# Altium schematic sheet PWR.SchDoc
size A4; SheetNumber: 1; SheetTotal: 14
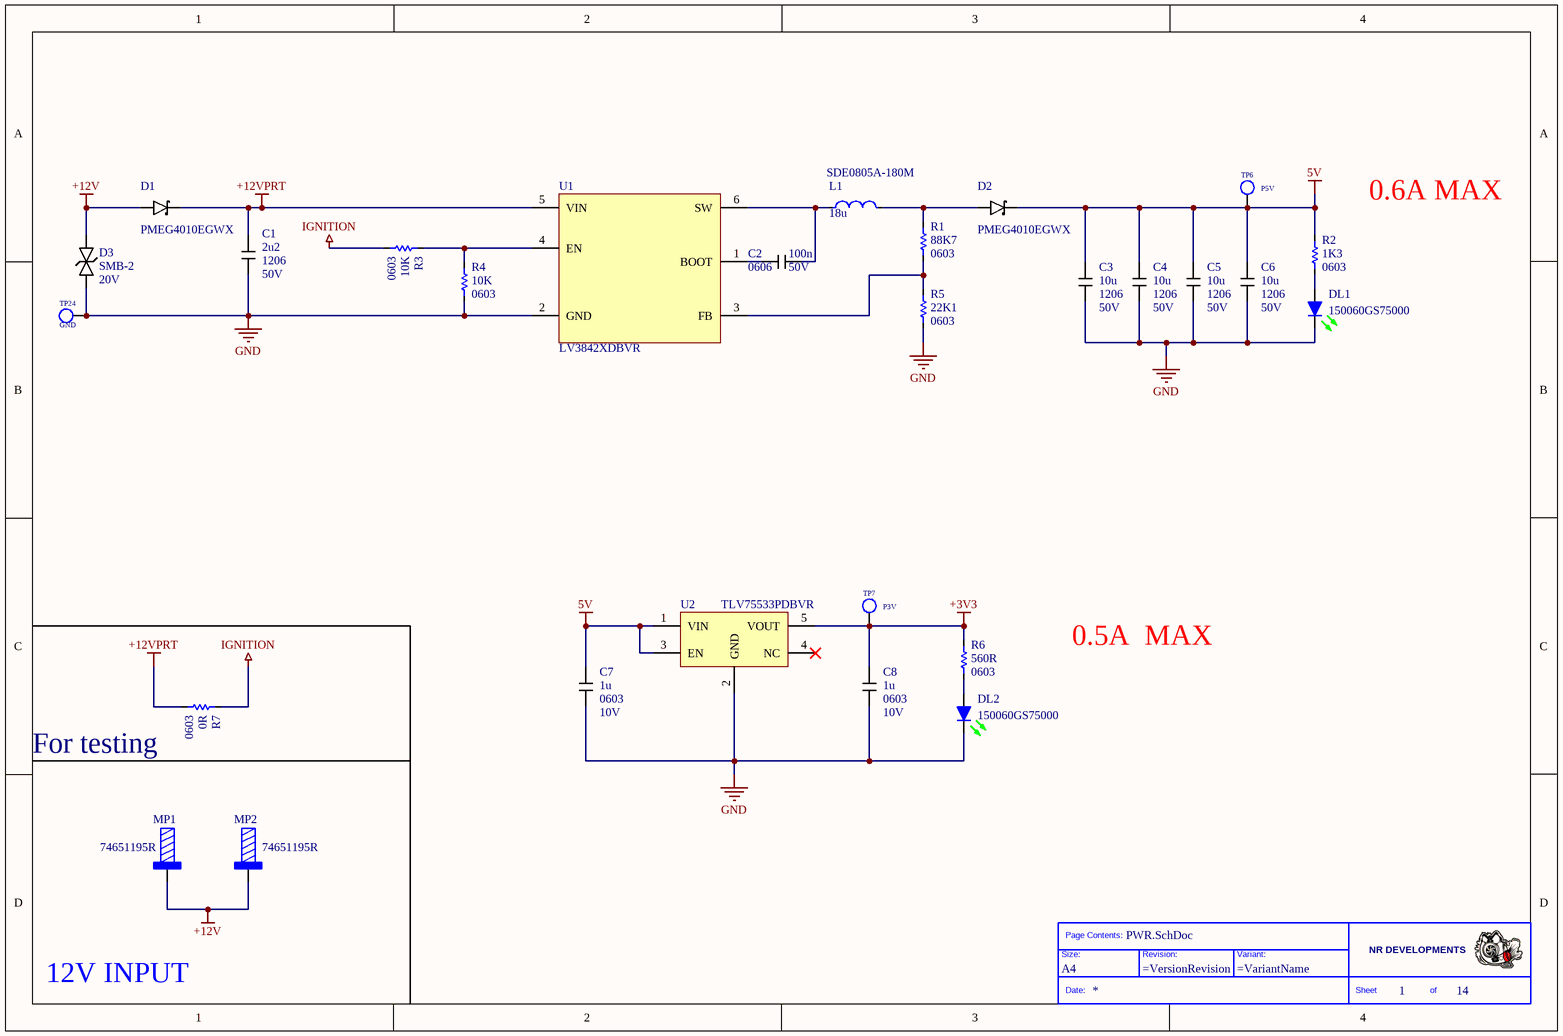
[diagram p0: PWR.SchDoc]

## Parts
*  Size: A4  (hidden comment: Title_Block)  (graphical)
C1  value 2u2  Case: 1206  Voltage: 50V  [CAPC3216X16M]  (hidden comment: CAP)
C2  value 100n  Case: 0606  Voltage: 50V  [CAPC1608X09M]  (hidden comment: CAP)
C3  value 10u  Case: 1206  Voltage: 50V  [CAPC3216X16M]  (hidden comment: CAP)
C4  value 10u  Case: 1206  Voltage: 50V  [CAPC3216X16M]  (hidden comment: CAP)
C5  value 10u  Case: 1206  Voltage: 50V  [CAPC3216X16M]  (hidden comment: CAP)
C6  value 10u  Case: 1206  Voltage: 50V  [CAPC3216X16M]  (hidden comment: CAP)
C7  value 1u  Case: 0603  Voltage: 10V  [CAPC1608X09M]  (hidden comment: CAP)
C8  value 1u  Case: 0603  Voltage: 10V  [CAPC1608X09M]  (hidden comment: CAP)
D1  value PMEG4010EGWX  [SODFL360X130-2M -AC]  (hidden comment: Diode_Schottky)
D2  value PMEG4010EGWX  [SODFL360X130-2M -AC]  (hidden comment: Diode_Schottky)
D3  Case: SMB-2  Voltage: 20V  [ONSC-SMB-2]  (hidden comment: Diode)
DL1  value 150060GS75000  [LED0603]  (hidden comment: LED_Green)
DL2  value 150060GS75000  [LED0603]  (hidden comment: LED_Green)
L1  value 18u  PartNumber: SDE0805A-180M  [BOURNS_SDE0805A]  (hidden comment: IND)
MP1  value 74651195R  [WURTH_74651195]  (hidden comment: Connector)
MP2  value 74651195R  [WURTH_74651195]  (hidden comment: Connector)
R1  value 88K7  Case: 0603  [RESC1608X06M]  (hidden comment: Res)
R2  value 1K3  Case: 0603  [RESC1608X06M]  (hidden comment: Res)
R3  value 10K  Case: 0603  [RESC1608X06M]  (hidden comment: Res)
R4  value 10K  Case: 0603  [RESC1608X06M]  (hidden comment: Res)
R5  value 22K1  Case: 0603  [RESC1608X06M]  (hidden comment: Res)
R6  value 560R  Case: 0603  [RESC1608X06M]  (hidden comment: Res)
R7  value 0R  Case: 0603  [RESC1608X06M]  (hidden comment: Res)
TP6  P5V  [TP_c200]
TP7  P3V  [TP_c200]
TP24  GND  [TP_c200]
U1  value LV3842XDBVR  [SOT95P280X145-6N]  (hidden comment: DC DC)
U2  value TLV75533PDBVR  [SOT95P280X145-5N]  (hidden comment: TLV75530PDBVR)

## Nets
5V: C3.1 C4.1 C5.1 C6.1 C7.1 D2.C R2.2 TP6.1 U2.1(VIN) U2.3(EN)
+3V3: C8.1 R6.2 TP7.1 U2.5(VOUT)
+12V: D1.A D3.2 MP1.1 MP2.1
+12VPRT: C1.1 D1.C R7.1 U1.5(VIN)
GND: C1.2 C3.2 C4.2 C5.2 C6.2 C7.2 C8.2 D3.1 DL1.C DL2.C R4.1 R5.1 TP24.1 U1.2(GND) U2.2(GND)
IGNITION: R3.1 R7.2
NetC2_1: C2.1 U1.1(BOOT)
NetC2_2: C2.2 L1.1 U1.6(SW)
NetD2_A: D2.A L1.2 R1.2
NetDL1_A: DL1.A R2.1
NetDL2_A: DL2.A R6.1
NetR1_1: R1.1 R5.2 U1.3(FB)
NetR3_2: R3.2 R4.2 U1.4(EN)

Not connected (* = marked no-connect by the designer): U2 4(NC)*

## Notes on the sheet
- 0.6A MAX
- 0.5A  MAX
- (near R7) For testing
- 12V INPUT
- (in symbol Title_Block) Page Contents:; NR DEVELOPMENTS; Size:; Revision:; Variant:; Date:; Sheet; of

## Library data of the parts
C1 = CAP: Manufacturer: KEMET; PartNumber: C1206C225K5RAC
C2 = CAP: Manufacturer: KEMET; PartNumber: C0603C104K5RACTU
C3-C6 = CAP: Manufacturer: Samsung Electro-Mechanics; PartNumber: CL31B106KBHNNNE
C7 C8 = CAP: Manufacturer: KEMET; PartNumber: C0603C105K8RACTU
D1 D2 = Diode_Schottky: Manufacturer: Nexperia; PartNumber: PMEG4010EGWX; Case: SOD123
D3 = Diode_TVS_Bid: Manufacturer: Littelfuse; Value: SZ1SMB20CAT3G; PartNumber: SZ1SMB20CAT3G
DL1 DL2 = LED_Green: Manufacturer: Wurth Elektronik; Case: 0603; PartNumber: 150060GS75000
L1 = IND: Manufacturer: BOURNS; Case: SDE0805A
MP1 MP2 = 74651195R: Manufacturer: Wurth Electronics; PartNumber: 74651195R
R1 = Resistor: Manufacturer: Vishay; PartNumber: CRCW060388K7FKEAC
R2 = Resistor: Manufacturer: Vishay; PartNumber: RC0603FR-071K3L
R3 R4 = Resistor: Manufacturer: YAGEO; PartNumber: AC0603FR-0710KL
R5 = Resistor: Manufacturer: Vishay; PartNumber: CRCW060322K1FKEA
R6 = Resistor: Manufacturer: Vishay; PartNumber: RC0603FR-07560RL
R7 = Resistor: Manufacturer: YAGEO; PartNumber: RC0603JR-070RL
TP6 TP7 TP24 = Test_Point
U1 = LV3842XDBVR: 4-V to 36-V, 600-mA synchronous step-down converter; Manufacturer: Texas Instruments; PartNumber: LV3842XDBVR; Case: 6-SOT-23
U2 = TLV75530PDBVR: LDO Voltage Regulators 500-mA high-PSRR low-IQ low-dropout voltage regulator with enable; Manufacturer: Texas Instruments; PartNumber: TLV75533PDBVR; Case: SOT-23-5